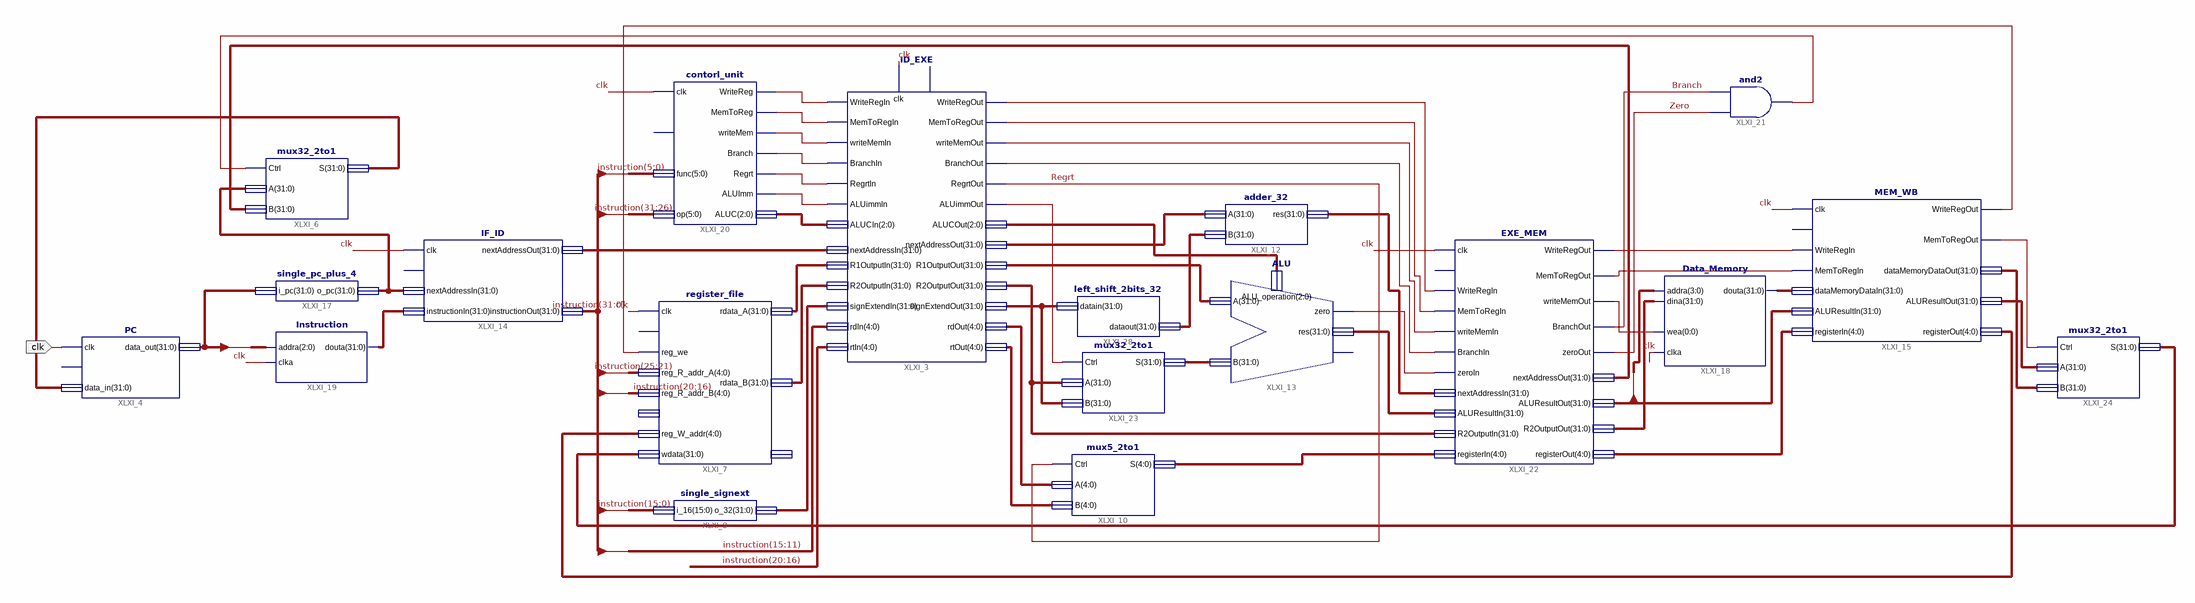
[diagram p0: schematic sheet 1]
// Xilinx ISE schematic pipelineCPU.sch (kintex7) as structural Verilog: 19 symbols, 1 ports
module pipelineCPU (
  input  clk
);

  wire Branch, Regrt, XLXN_27, XLXN_28, XLXN_29, XLXN_30, XLXN_31, XLXN_32, XLXN_56, XLXN_70, XLXN_71,
       XLXN_76, XLXN_77, XLXN_87, XLXN_93, XLXN_96, XLXN_104, XLXN_105, XLXN_106, Zero;
  wire [0:0] XLXN_78;
  wire [2:0] XLXN_33, XLXN_73;
  wire [4:0] XLXN_44, XLXN_45, XLXN_84, XLXN_98, XLXN_102;
  wire [31:0] ALUResultOut, instruction, PC_Out, XLXN_7, XLXN_8, XLXN_10, XLXN_12, XLXN_19, XLXN_20, XLXN_23,
       XLXN_35, XLXN_36, XLXN_38, XLXN_46, XLXN_50, XLXN_51, XLXN_52, XLXN_79, XLXN_82, XLXN_91, XLXN_94,
       XLXN_95, XLXN_97, XLXN_103;

  ID_EXE XLXI_3 (
    .WriteRegIn(XLXN_27), .MemToRegIn(XLXN_28), .writeMemIn(XLXN_29), .BranchIn(XLXN_30), .RegrtIn(XLXN_31),
    .ALUimmIn(XLXN_32), .WriteRegOut(XLXN_56), .MemToRegOut(XLXN_106), .writeMemOut(XLXN_105),
    .BranchOut(XLXN_104), .RegrtOut(Regrt), .ALUimmOut(XLXN_71), .ALUCOut(XLXN_73), .nextAddressOut(XLXN_35),
    .R1OutputOut(XLXN_51), .R2OutputOut(XLXN_46), .signExtendOut(XLXN_38), .rdOut(XLXN_44), .rtOut(XLXN_45),
    .clk(clk), .ALUCIn(XLXN_33), .R1OutputIn(XLXN_19), .nextAddressIn(XLXN_12), .R2OutputIn(XLXN_20),
    .signExtendIn(XLXN_23), .rdIn(instruction[15:11]), .rtIn(instruction[20:16]));  // open: rst
  PC XLXI_4 (.clk(clk), .data_in(XLXN_10), .data_out(PC_Out));  // open: rst
  mux32_2to1 XLXI_6 (.Ctrl(XLXN_87), .A(XLXN_7), .B(XLXN_79), .S(XLXN_10));
  register_file XLXI_7 (
    .clk(clk), .reg_we(XLXN_96), .reg_R_addr_A(instruction[25:21]), .reg_R_addr_B(instruction[20:16]),
    .reg_W_addr(XLXN_98), .wdata(XLXN_97), .rdata_A(XLXN_19), .rdata_B(XLXN_20));  // open: rst, reg_R_addr_C, rdata_C
  single_signext XLXI_8 (.i_16(instruction[15:0]), .o_32(XLXN_23));
  mux5_2to1 XLXI_10 (.Ctrl(Regrt), .A(XLXN_44), .B(XLXN_45), .S(XLXN_102));
  adder_32 XLXI_12 (.A(XLXN_35), .B(XLXN_36), .res(XLXN_103));
  ALU XLXI_13 (.A(XLXN_51), .B(XLXN_50), .zero(XLXN_70), .res(XLXN_52), .ALU_operation(XLXN_73));  // open: overflow
  IF_ID XLXI_14 (
    .clk(clk), .nextAddressIn(XLXN_7), .instructionIn(XLXN_8), .nextAddressOut(XLXN_12),
    .instructionOut(instruction));  // open: rst
  MEM_WB XLXI_15 (
    .clk(clk), .WriteRegIn(XLXN_76), .MemToRegIn(XLXN_77), .dataMemoryDataIn(XLXN_82),
    .ALUResultIn(ALUResultOut), .registerIn(XLXN_84), .WriteRegOut(XLXN_96), .MemToRegOut(XLXN_93),
    .dataMemoryDataOut(XLXN_95), .ALUResultOut(XLXN_94), .registerOut(XLXN_98));  // open: rst
  single_pc_plus_4 XLXI_17 (.i_pc(PC_Out), .o_pc(XLXN_7));
  Instruction XLXI_19 (.addra(PC_Out[2:0]), .clka(clk), .douta(XLXN_8));
  contorl_unit XLXI_20 (
    .clk(clk), .func(instruction[5:0]), .op(instruction[31:26]), .WriteReg(XLXN_27), .MemToReg(XLXN_28),
    .writeMem(XLXN_29), .Branch(XLXN_30), .Regrt(XLXN_31), .ALUImm(XLXN_32), .ALUC(XLXN_33));  // open: rst
  and XLXI_21 (XLXN_87, Zero, Branch);
  EXE_MEM XLXI_22 (
    .clk(clk), .WriteRegIn(XLXN_56), .MemToRegIn(XLXN_106), .writeMemIn(XLXN_105), .BranchIn(XLXN_104),
    .zeroIn(XLXN_70), .nextAddressIn(XLXN_103), .ALUResultIn(XLXN_52), .R2OutputIn(XLXN_46),
    .registerIn(XLXN_102), .WriteRegOut(XLXN_76), .MemToRegOut(XLXN_77), .writeMemOut(XLXN_78[0]),
    .BranchOut(Branch), .zeroOut(Zero), .nextAddressOut(XLXN_79), .ALUResultOut(ALUResultOut),
    .R2OutputOut(XLXN_91), .registerOut(XLXN_84));  // open: rst
  mux32_2to1 XLXI_23 (.Ctrl(XLXN_71), .A(XLXN_46), .B(XLXN_38), .S(XLXN_50));
  mux32_2to1 XLXI_24 (.Ctrl(XLXN_93), .A(XLXN_94), .B(XLXN_95), .S(XLXN_97));
  Data_Memory XLXI_18 (.addra(ALUResultOut[3:0]), .dina(XLXN_91), .wea(XLXN_78[0]), .clka(clk), .douta(XLXN_82));
  left_shift_2bits_32 XLXI_28 (.dataout(XLXN_36), .datain(XLXN_38));
endmodule
